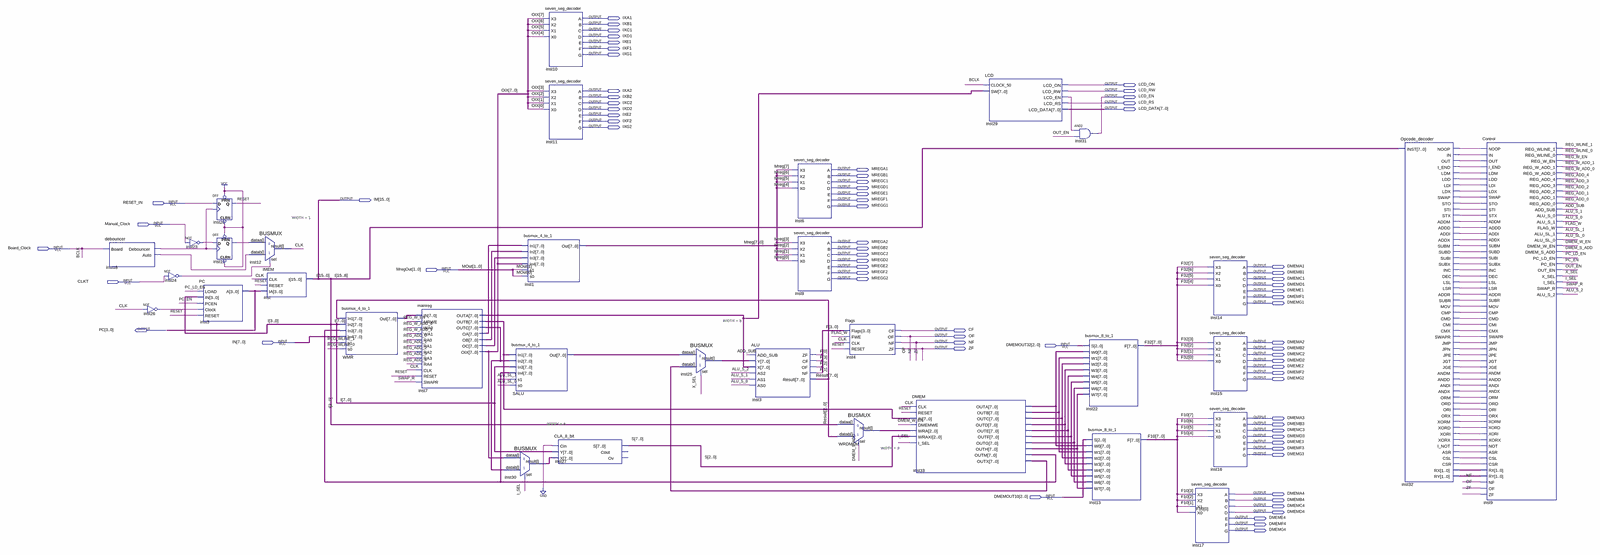
[diagram p0: schematic sheet, whole]
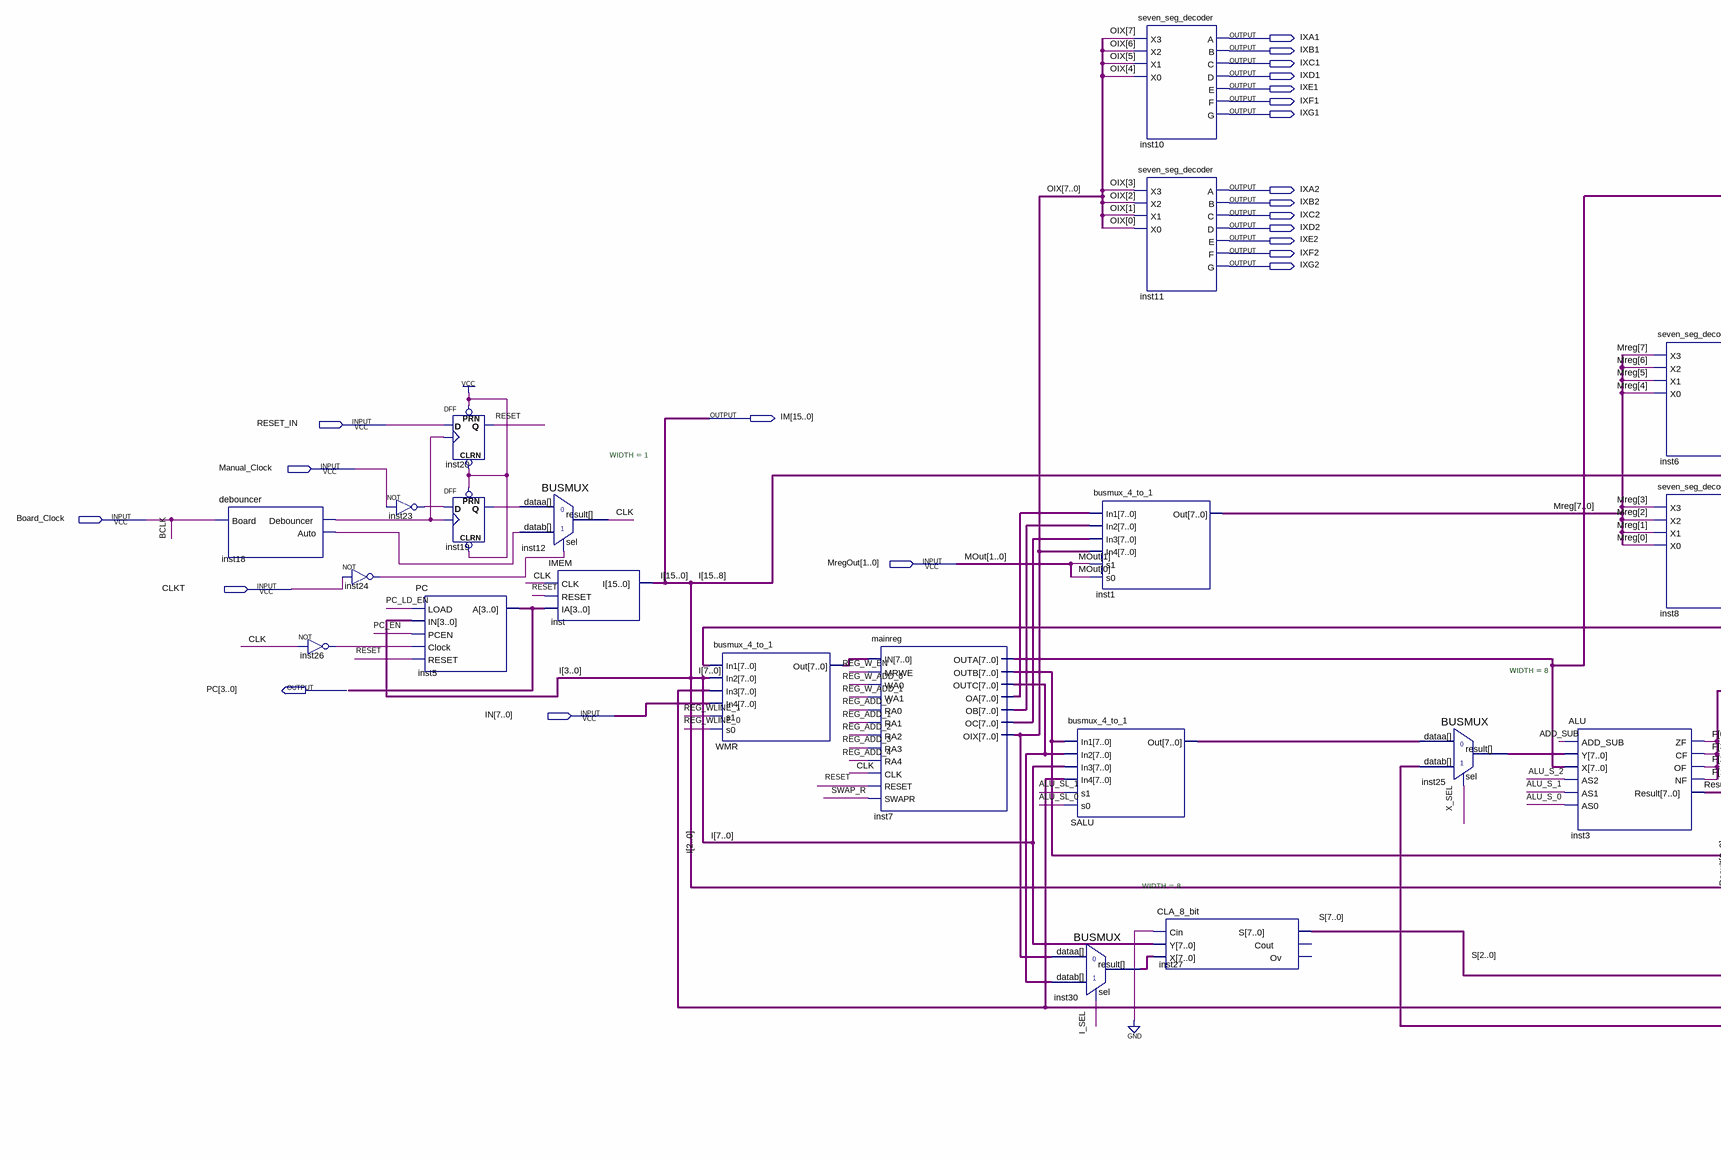
[diagram p1: schematic sheet, left part]
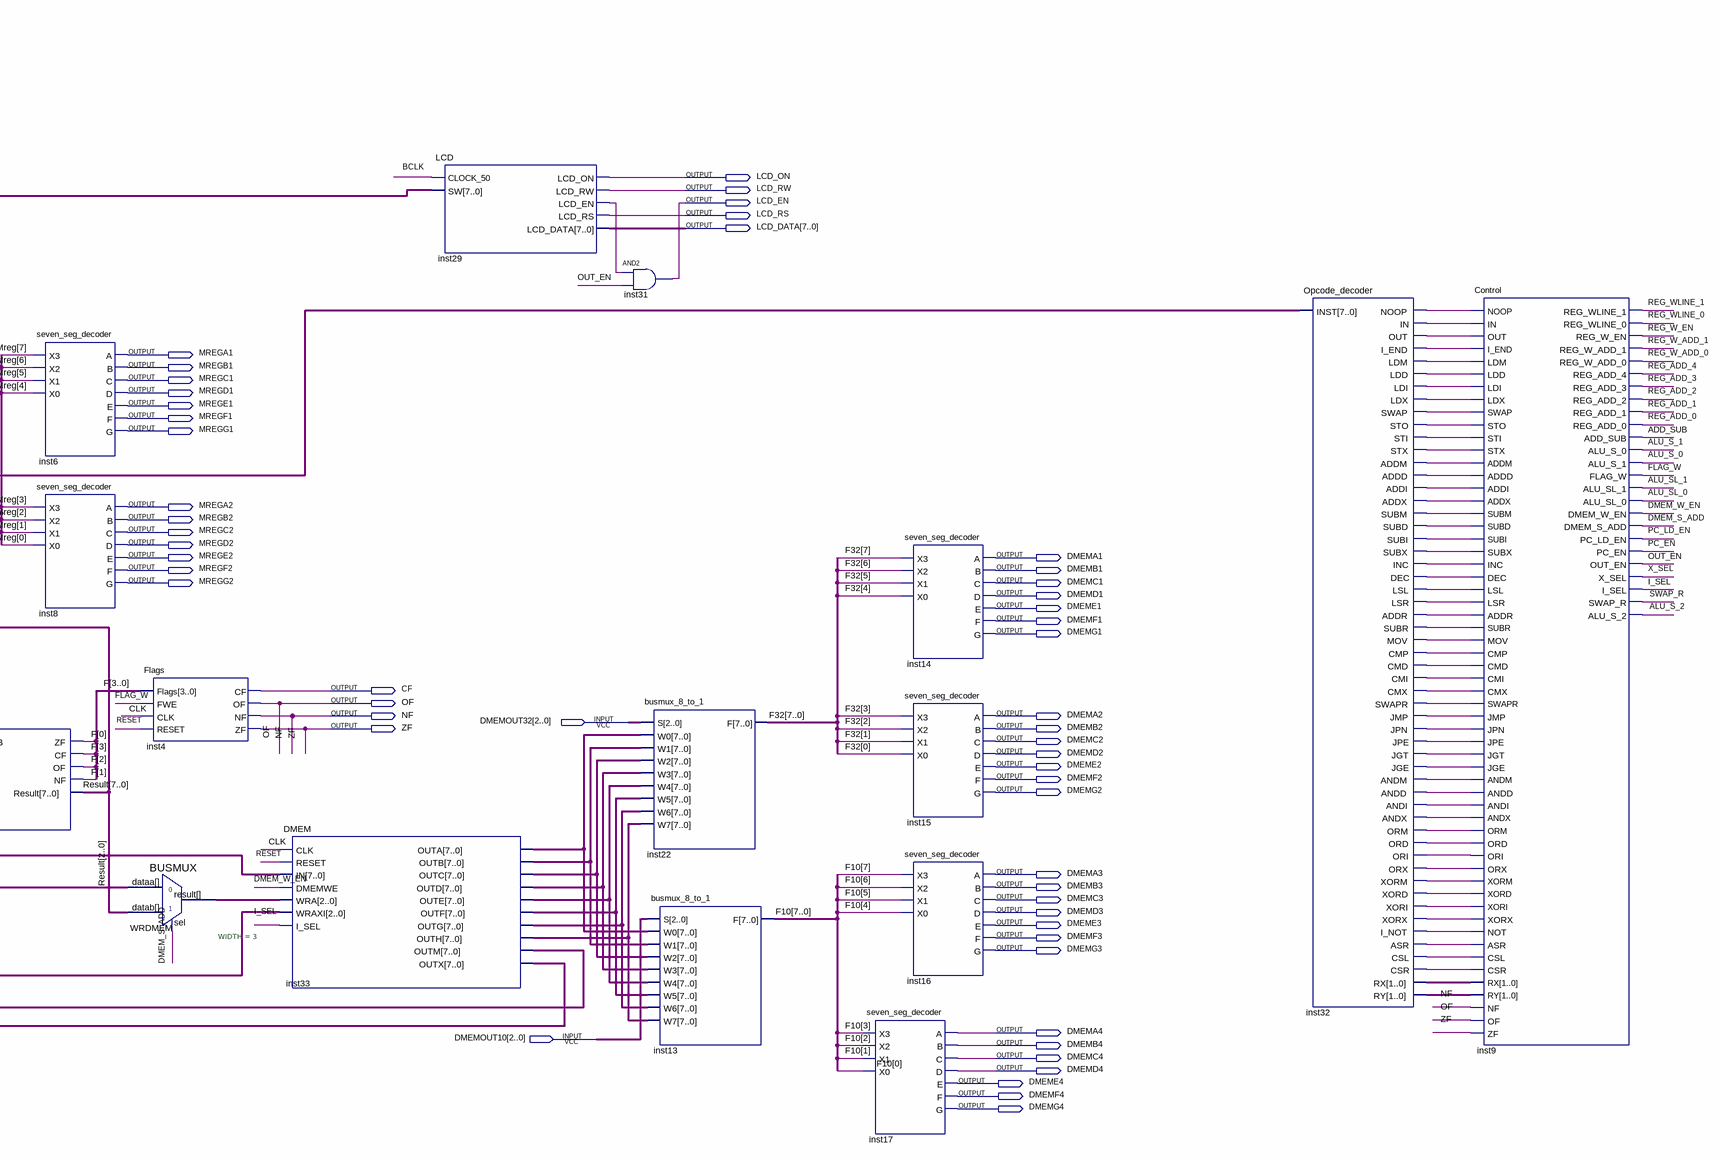
[diagram p2: schematic sheet, right part]
// Quartus schematic CPU.bdf as structural Verilog: 34 symbols, 75 pins
module CPU (
  input  RESET_IN,
  input  Manual_Clock,
  input  Board_Clock,
  input  [1:0] MregOut,
  input  CLKT,
  input  [7:0] IN,
  input  [2:0] DMEMOUT32,
  input  [2:0] DMEMOUT10,
  output IXA1,
  output IXB1,
  output IXC1,
  output IXD1,
  output IXE1,
  output IXF1,
  output IXG1,
  output LCD_ON,
  output IXA2,
  output LCD_RW,
  output IXB2,
  output LCD_EN,
  output IXC2,
  output LCD_RS,
  output IXD2,
  output [7:0] LCD_DATA,
  output IXE2,
  output IXF2,
  output IXG2,
  output MREGA1,
  output MREGB1,
  output MREGC1,
  output MREGD1,
  output MREGE1,
  output [15:0] IM,
  output MREGF1,
  output MREGG1,
  output MREGA2,
  output MREGB2,
  output MREGC2,
  output MREGD2,
  output MREGE2,
  output DMEMA1,
  output MREGF2,
  output DMEMB1,
  output MREGG2,
  output DMEMC1,
  output DMEMD1,
  output DMEME1,
  output DMEMF1,
  output DMEMG1,
  output [3:0] PC,
  output CF,
  output OF,
  output NF,
  output DMEMA2,
  output ZF,
  output DMEMB2,
  output DMEMC2,
  output DMEMD2,
  output DMEME2,
  output DMEMF2,
  output DMEMG2,
  output DMEMA3,
  output DMEMB3,
  output DMEMC3,
  output DMEMD3,
  output DMEME3,
  output DMEMF3,
  output DMEMG3,
  output DMEMA4,
  output DMEMB4,
  output DMEMC4,
  output DMEMD4,
  output DMEME4,
  output DMEMF4,
  output DMEMG4
);

  wire ADD_SUB, ALU_S_0, ALU_S_1, ALU_S_2, ALU_SL_0, ALU_SL_1, CLK, DMEM_S_ADD, DMEM_W_EN, FLAG_W, I_SEL,
       inst18_auto, inst18_debouncer, inst19_q, inst23_out, inst24_out, inst26_out, inst29_lcd_en,
       inst32_addd, inst32_addi, inst32_addm, inst32_addr, inst32_addx, inst32_andd, inst32_andi,
       inst32_andm, inst32_andx, inst32_asr, inst32_cmd, inst32_cmi, inst32_cmp, inst32_cmx, inst32_csl,
       inst32_csr, inst32_dec, inst32_i_end, inst32_i_not, inst32_in, inst32_inc, inst32_jge, inst32_jgt,
       inst32_jmp, inst32_jpe, inst32_jpn, inst32_ldd, inst32_ldi, inst32_ldm, inst32_ldx, inst32_lsl,
       inst32_lsr, inst32_mov, inst32_noop, inst32_ord, inst32_ori, inst32_orm, inst32_orx, inst32_out,
       inst32_sti, inst32_sto, inst32_stx, inst32_subd, inst32_subi, inst32_subm, inst32_subr, inst32_subx,
       inst32_swap, inst32_swapr, inst32_xord, inst32_xori, inst32_xorm, inst32_xorx, OUT_EN, PC_EN,
       PC_LD_EN, REG_ADD_0, REG_ADD_1, REG_ADD_2, REG_ADD_3, REG_ADD_4, REG_W_ADD_0, REG_W_ADD_1, REG_W_EN,
       REG_WLINE_0, REG_WLINE_1, RESET, SWAP_R, X_SEL;
  wire [1:0] inst32_rx, inst32_ry;
  wire [2:0] WRDMEM_result;
  wire [3:0] F;
  wire [7:0] F10, F32, inst7_oa, inst7_ob, inst7_oc, inst7_outa, inst7_outb, inst7_outc, inst25_result,
       inst30_result, inst33_outa, inst33_outb, inst33_outc, inst33_outd, inst33_oute, inst33_outf,
       inst33_outg, inst33_outh, inst33_outm, inst33_outx, Mreg, OIX, Result, S, SALU_out, WMR_out;

  debouncer inst18 (.Board(Board_Clock), .Debouncer(inst18_debouncer), .Auto(inst18_auto));
  not inst24 (inst24_out, CLKT);
  not inst26 (inst26_out, CLK);
  not inst23 (inst23_out, Manual_Clock);
  DFF inst20 (.CLRN(1'b1), .CLK(inst18_debouncer), .D(RESET_IN), .PRN(1'b1), .Q(RESET));
  DFF inst19 (.CLRN(1'b1), .CLK(inst18_debouncer), .D(inst23_out), .PRN(1'b1), .Q(inst19_q));
  PC inst5 (.LOAD(PC_LD_EN), .IN(IM[3:0]), .PCEN(PC_EN), .Clock(inst26_out), .RESET(RESET), .A(PC));
  BUSMUX #(.WIDTH(1)) inst12 (.datab(inst18_auto), .sel(inst24_out), .dataa(inst19_q), .result(CLK));
  IMEM inst (.CLK(CLK), .RESET(RESET), .IA(PC), .I(IM));
  busmux_4_to_1 WMR (
    .In1(Result), .In2(IM[7:0]), .In3(inst33_outm), .In4(IN), .s1(REG_WLINE_1), .s0(REG_WLINE_0),
    .Out(WMR_out));
  mainreg inst7 (
    .IN(WMR_out), .MRWE(REG_W_EN), .WA0(REG_W_ADD_0), .WA1(REG_W_ADD_1), .RA0(REG_ADD_0), .RA1(REG_ADD_1),
    .RA2(REG_ADD_2), .RA3(REG_ADD_3), .RA4(REG_ADD_4), .CLK(CLK), .RESET(RESET), .SWAPR(SWAP_R),
    .OUTA(inst7_outa), .OUTB(inst7_outb), .OUTC(inst7_outc), .OA(inst7_oa), .OB(inst7_ob), .OC(inst7_oc),
    .OIX(OIX));
  BUSMUX #(.WIDTH(8)) inst30 (.datab(inst7_outc), .sel(I_SEL), .dataa(OIX), .result(inst30_result));
  busmux_4_to_1 inst1 (
    .In1(inst7_oa), .In2(inst7_ob), .In3(inst7_oc), .In4(OIX), .s1(MregOut[1]), .s0(MregOut[0]), .Out(Mreg));
  busmux_4_to_1 SALU (
    .In1(inst7_outb), .In2(inst7_outc), .In3(IM[7:0]), .In4(inst33_outm), .s1(ALU_SL_1), .s0(ALU_SL_0),
    .Out(SALU_out));
  seven_seg_decoder inst10 (
    .X3(OIX[7]), .X2(OIX[6]), .X1(OIX[5]), .X0(OIX[4]), .A(IXA1), .B(IXB1), .C(IXC1), .D(IXD1), .E(IXE1),
    .F(IXF1), .G(IXG1));
  seven_seg_decoder inst11 (
    .X3(OIX[3]), .X2(OIX[2]), .X1(OIX[1]), .X0(OIX[0]), .A(IXA2), .B(IXB2), .C(IXC2), .D(IXD2), .E(IXE2),
    .F(IXF2), .G(IXG2));
  CLA_8_bit inst27 (.Cin(1'b0), .Y(IM[7:0]), .X(inst30_result), .S(S));  // open: Cout, Ov
  BUSMUX #(.WIDTH(8)) inst25 (.datab(inst33_outx), .sel(X_SEL), .dataa(SALU_out), .result(inst25_result));
  ALU inst3 (
    .ADD_SUB(ADD_SUB), .Y(inst25_result), .X(inst7_outa), .AS2(ALU_S_2), .AS1(ALU_S_1), .AS0(ALU_S_0),
    .ZF(F[0]), .CF(F[3]), .OF(F[2]), .NF(F[1]), .Result(Result));
  seven_seg_decoder inst6 (
    .X3(Mreg[7]), .X2(Mreg[6]), .X1(Mreg[5]), .X0(Mreg[4]), .A(MREGA1), .B(MREGB1), .C(MREGC1), .D(MREGD1),
    .E(MREGE1), .F(MREGF1), .G(MREGG1));
  seven_seg_decoder inst8 (
    .X3(Mreg[3]), .X2(Mreg[2]), .X1(Mreg[1]), .X0(Mreg[0]), .A(MREGA2), .B(MREGB2), .C(MREGC2), .D(MREGD2),
    .E(MREGE2), .F(MREGF2), .G(MREGG2));
  Flags inst4 (.Flags(F), .FWE(FLAG_W), .CLK(CLK), .RESET(RESET), .CF(CF), .OF(OF), .NF(NF), .ZF(ZF));
  BUSMUX #(.WIDTH(3)) WRDMEM (.datab(Result[2:0]), .sel(DMEM_S_ADD), .dataa(IM[2:0]), .result(WRDMEM_result));
  DMEM inst33 (
    .CLK(CLK), .RESET(RESET), .IN(inst7_outb), .DMEMWE(DMEM_W_EN), .WRA(WRDMEM_result), .WRAXI(S[2:0]),
    .I_SEL(I_SEL), .OUTA(inst33_outa), .OUTB(inst33_outb), .OUTC(inst33_outc), .OUTD(inst33_outd),
    .OUTE(inst33_oute), .OUTF(inst33_outf), .OUTG(inst33_outg), .OUTH(inst33_outh), .OUTM(inst33_outm),
    .OUTX(inst33_outx));
  LCD inst29 (
    .CLOCK_50(Board_Clock), .SW(inst7_outa), .LCD_ON(LCD_ON), .LCD_RW(LCD_RW), .LCD_EN(inst29_lcd_en),
    .LCD_RS(LCD_RS), .LCD_DATA(LCD_DATA));
  and inst31 (LCD_EN, inst29_lcd_en, OUT_EN);
  busmux_8_to_1 inst22 (
    .S(DMEMOUT32), .W0(inst33_outa), .W1(inst33_outb), .W2(inst33_outc), .W3(inst33_outd), .W4(inst33_oute),
    .W5(inst33_outf), .W6(inst33_outg), .W7(inst33_outh), .F(F32));
  busmux_8_to_1 inst13 (
    .S(DMEMOUT10), .W0(inst33_outa), .W1(inst33_outb), .W2(inst33_outc), .W3(inst33_outd), .W4(inst33_oute),
    .W5(inst33_outf), .W6(inst33_outg), .W7(inst33_outh), .F(F10));
  seven_seg_decoder inst14 (
    .X3(F32[7]), .X2(F32[6]), .X1(F32[5]), .X0(F32[4]), .A(DMEMA1), .B(DMEMB1), .C(DMEMC1), .D(DMEMD1),
    .E(DMEME1), .F(DMEMF1), .G(DMEMG1));
  seven_seg_decoder inst15 (
    .X3(F32[3]), .X2(F32[2]), .X1(F32[1]), .X0(F32[0]), .A(DMEMA2), .B(DMEMB2), .C(DMEMC2), .D(DMEMD2),
    .E(DMEME2), .F(DMEMF2), .G(DMEMG2));
  seven_seg_decoder inst16 (
    .X3(F10[7]), .X2(F10[6]), .X1(F10[5]), .X0(F10[4]), .A(DMEMA3), .B(DMEMB3), .C(DMEMC3), .D(DMEMD3),
    .E(DMEME3), .F(DMEMF3), .G(DMEMG3));
  seven_seg_decoder inst17 (
    .X3(F10[3]), .X2(F10[2]), .X1(F10[1]), .X0(F10[0]), .A(DMEMA4), .B(DMEMB4), .C(DMEMC4), .D(DMEMD4),
    .E(DMEME4), .F(DMEMF4), .G(DMEMG4));
  Opcode_decoder inst32 (
    .INST(IM[15:8]), .NOOP(inst32_noop), .IN(inst32_in), .OUT(inst32_out), .I_END(inst32_i_end),
    .LDM(inst32_ldm), .LDD(inst32_ldd), .LDI(inst32_ldi), .LDX(inst32_ldx), .SWAP(inst32_swap),
    .STO(inst32_sto), .STI(inst32_sti), .STX(inst32_stx), .ADDM(inst32_addm), .ADDD(inst32_addd),
    .ADDI(inst32_addi), .ADDX(inst32_addx), .SUBM(inst32_subm), .SUBD(inst32_subd), .SUBI(inst32_subi),
    .SUBX(inst32_subx), .INC(inst32_inc), .DEC(inst32_dec), .LSL(inst32_lsl), .LSR(inst32_lsr),
    .ADDR(inst32_addr), .SUBR(inst32_subr), .MOV(inst32_mov), .CMP(inst32_cmp), .CMD(inst32_cmd),
    .CMI(inst32_cmi), .CMX(inst32_cmx), .SWAPR(inst32_swapr), .JMP(inst32_jmp), .JPN(inst32_jpn),
    .JPE(inst32_jpe), .JGT(inst32_jgt), .JGE(inst32_jge), .ANDM(inst32_andm), .ANDD(inst32_andd),
    .ANDI(inst32_andi), .ANDX(inst32_andx), .ORM(inst32_orm), .ORD(inst32_ord), .ORI(inst32_ori),
    .ORX(inst32_orx), .XORM(inst32_xorm), .XORD(inst32_xord), .XORI(inst32_xori), .XORX(inst32_xorx),
    .I_NOT(inst32_i_not), .ASR(inst32_asr), .CSL(inst32_csl), .CSR(inst32_csr), .RX(inst32_rx), .RY(inst32_ry));
  Control inst9 (
    .NOOP(inst32_noop), .IN(inst32_in), .OUT(inst32_out), .I_END(inst32_i_end), .LDM(inst32_ldm),
    .LDD(inst32_ldd), .LDI(inst32_ldi), .LDX(inst32_ldx), .SWAP(inst32_swap), .STO(inst32_sto),
    .STI(inst32_sti), .STX(inst32_stx), .ADDM(inst32_addm), .ADDD(inst32_addd), .ADDI(inst32_addi),
    .ADDX(inst32_addx), .SUBM(inst32_subm), .SUBD(inst32_subd), .SUBI(inst32_subi), .SUBX(inst32_subx),
    .INC(inst32_inc), .DEC(inst32_dec), .LSL(inst32_lsl), .LSR(inst32_lsr), .ADDR(inst32_addr),
    .SUBR(inst32_subr), .MOV(inst32_mov), .CMP(inst32_cmp), .CMD(inst32_cmd), .CMI(inst32_cmi),
    .CMX(inst32_cmx), .SWAPR(inst32_swapr), .JMP(inst32_jmp), .JPN(inst32_jpn), .JPE(inst32_jpe),
    .JGT(inst32_jgt), .JGE(inst32_jge), .ANDM(inst32_andm), .ANDD(inst32_andd), .ANDI(inst32_andi),
    .ANDX(inst32_andx), .ORM(inst32_orm), .ORD(inst32_ord), .ORI(inst32_ori), .ORX(inst32_orx),
    .XORM(inst32_xorm), .XORD(inst32_xord), .XORI(inst32_xori), .XORX(inst32_xorx), .NOT(inst32_i_not),
    .ASR(inst32_asr), .CSL(inst32_csl), .CSR(inst32_csr), .RX(inst32_rx), .RY(inst32_ry), .NF(NF), .OF(OF),
    .ZF(ZF), .REG_WLINE_1(REG_WLINE_1), .REG_WLINE_0(REG_WLINE_0), .REG_W_EN(REG_W_EN),
    .REG_W_ADD_1(REG_W_ADD_1), .REG_W_ADD_0(REG_W_ADD_0), .REG_ADD_4(REG_ADD_4), .REG_ADD_3(REG_ADD_3),
    .REG_ADD_2(REG_ADD_2), .REG_ADD_1(REG_ADD_1), .REG_ADD_0(REG_ADD_0), .ADD_SUB(ADD_SUB),
    .ALU_S_0(ALU_S_1), .ALU_S_1(ALU_S_0), .FLAG_W(FLAG_W), .ALU_SL_1(ALU_SL_1), .ALU_SL_0(ALU_SL_0),
    .DMEM_W_EN(DMEM_W_EN), .DMEM_S_ADD(DMEM_S_ADD), .PC_LD_EN(PC_LD_EN), .PC_EN(PC_EN), .OUT_EN(OUT_EN),
    .X_SEL(X_SEL), .I_SEL(I_SEL), .SWAP_R(SWAP_R), .ALU_S_2(ALU_S_2));

  // Other names for the same wires on the sheet: BCLK = Board_Clock; I[15:0] = IM; MOut[1:0] = MregOut
endmodule
